# EAGLE design transimp (EAGLE 9.5.2)

## Sheet 1 of 2
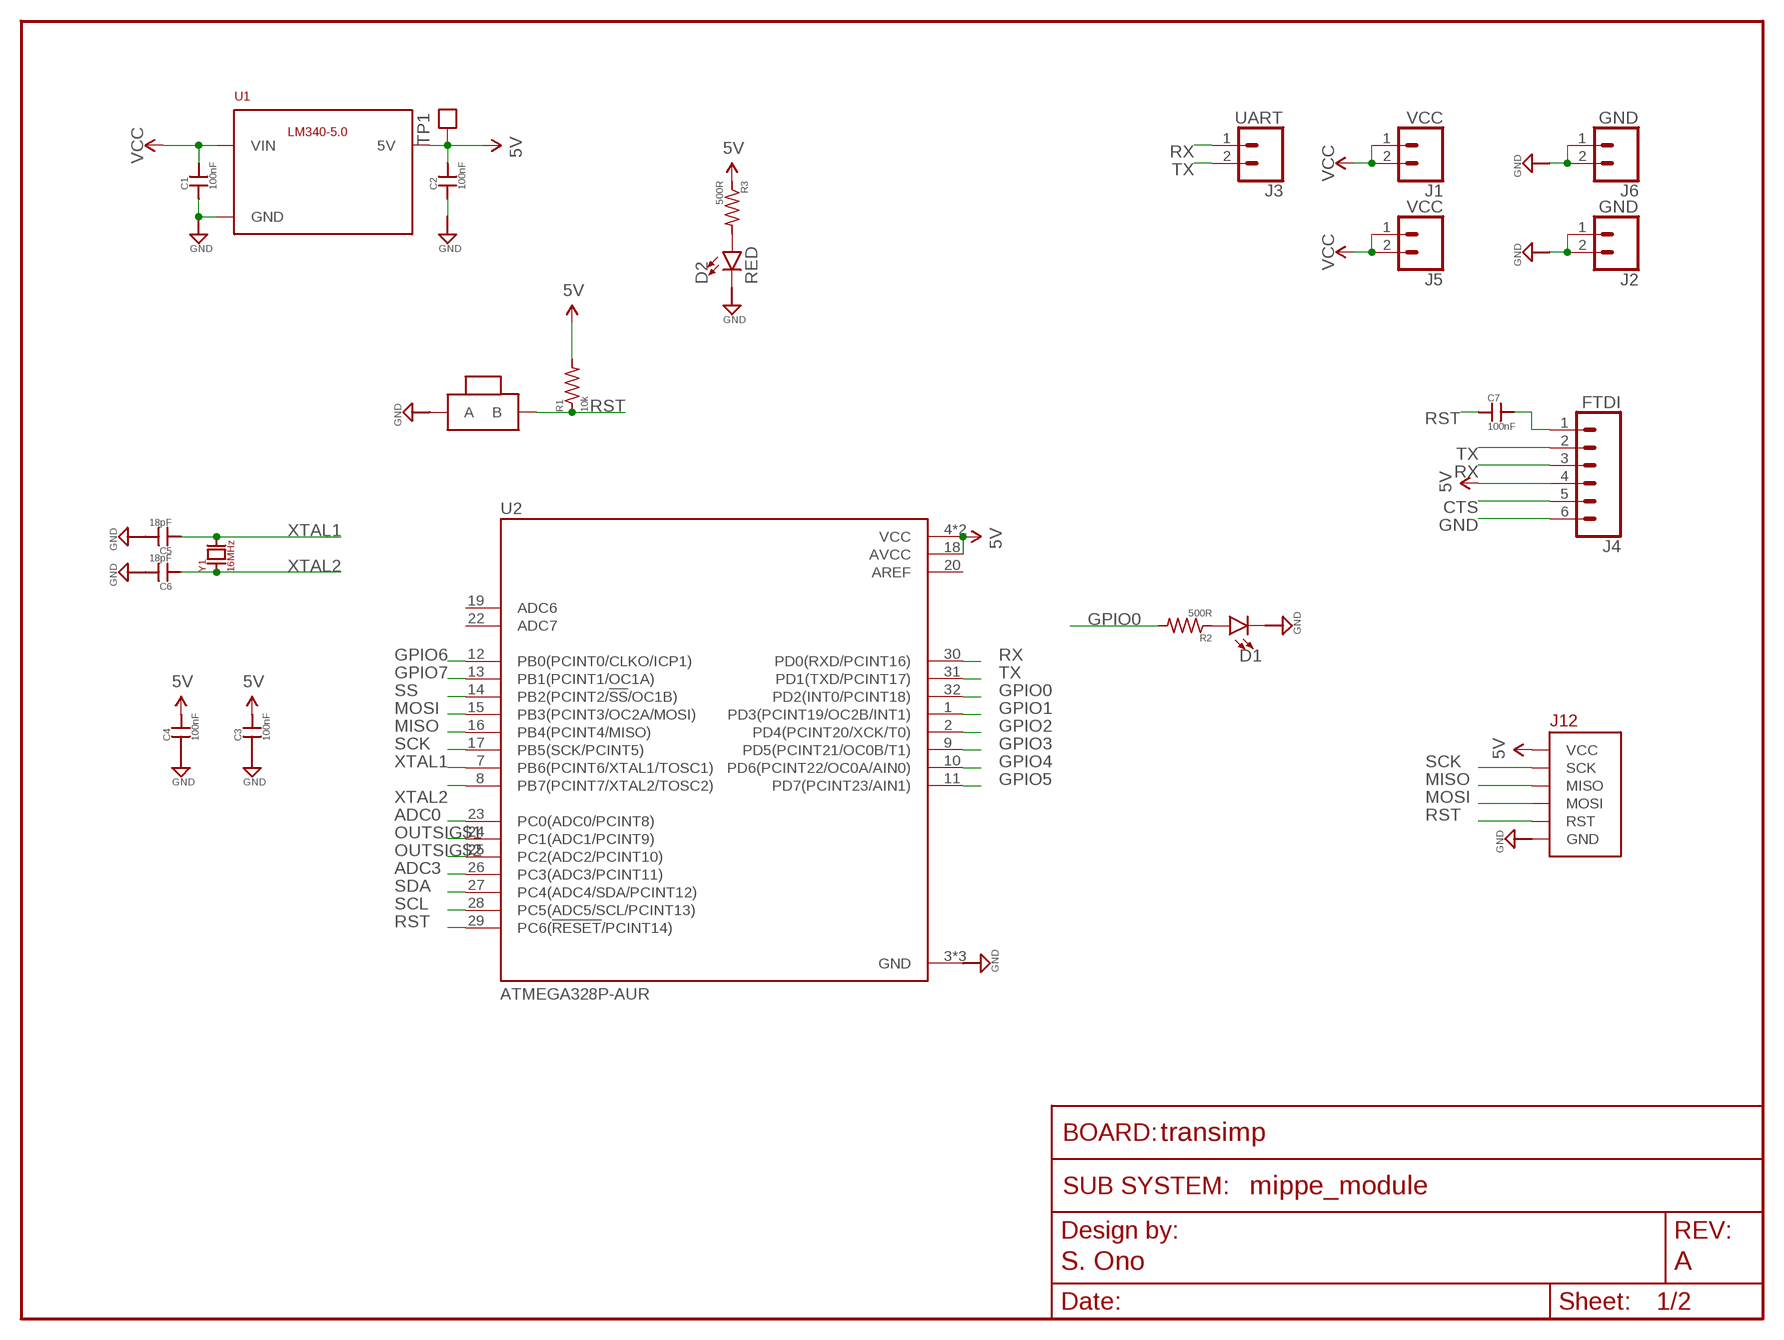
[diagram p0: schematic, sheet 1]
FRAME2 (FRAME_SCHEMATIC): AUTHOR: S. Ono; REV: A; SUBSYSTEM_NAME: mippe_module

### Parts
C1  100nF  CAP0402-CAP  [0402-CAP]
C2  100nF  CAP0402-CAP  [0402-CAP]
C3  100nF  CAP0402-CAP  [0402-CAP]
C4  100nF  CAP0402-CAP  [0402-CAP]
C5  18pF  CAP0402-CAP  [0402-CAP]
C6  18pF  CAP0402-CAP  [0402-CAP]
C7  100nF  CAP0402-CAP  [0402-CAP]
D1  LED0603  [LED-0603]
D2  RED  LED0603  [LED-0603]
J1  VCC  CONN_02  [1X02]
J2  GND  CONN_02  [1X02]
J3  UART  CONN_02  [1X02]
J4  FTDI  CONN_06NO_SILK_FEMALE_PTH  [1X06_NO_SILK]
J5  VCC  CONN_02  [1X02]
J6  GND  CONN_02  [1X02]
J12  BURNIN  [BURNIN]
R1  10k  R-US_R0402  [R0402]
R2  500R  R-US_R0402  [R0402]
R3  500R  R-US_R0402  [R0402]
SW1  BTN-PTS810  [BTN_PTS810]
TP1  TEST_POINTTHRU  [TEST_POINT]
U1  LM340MPX-5.0230  [SOT230P700X180-4N]
U2  ATMEGA328P-AUR  [QFP80P900X900X120-32N]
Y1  16MHz  CRYSTAL_SMOL  [XTAL500X320X130N]

### Nets
5V: C2.2 C3.2 C4.2 J4.4 J12.3.3V(VCC) R1.2 R3.1 TP1.1 U1.3(5V) U2.4(VCC) U2.6(VCC) U2.18(AVCC) ; also sheet 2
ADC0: U2.23(PC0(ADC0/PCINT8))
ADC3: U2.26(PC3(ADC3/PCINT11))
CTS: J4.5
GND: C1.1 C2.1 C3.1 C4.1 C5.2 C6.2 D1.C D2.C J2.1 J2.2 J4.6 J6.1 J6.2 J12.GND SW1.1(A) SW1.2(A) U1.2(GND) U1.4(GND) U2.3(GND) U2.5(GND) U2.21(GND) ; also sheet 2
GPIO0: R2.2 U2.32(PD2(INT0/PCINT18))
GPIO1: U2.1(PD3(PCINT19/OC2B/INT1))
GPIO2: U2.2(PD4(PCINT20/XCK/T0))
GPIO3: U2.9(PD5(PCINT21/OC0B/T1))
GPIO4: U2.10(PD6(PCINT22/OC0A/AIN0))
GPIO5: U2.11(PD7(PCINT23/AIN1))
GPIO6: U2.12(PB0(PCINT0/CLKO/ICP1))
GPIO7: U2.13(PB1(PCINT1/OC1A))
MISO: J12.MISO U2.16(PB4(PCINT4/MISO))
MOSI: J12.MOSI U2.15(PB3(PCINT3/OC2A/MOSI))
N$1: D1.A R2.1
N$2: D2.A R3.2
N$3: C7.2 J4.1
OUTSIG$1: U2.24(PC1(ADC1/PCINT9)) ; also sheet 2
OUTSIG$2: U2.25(PC2(ADC2/PCINT10)) ; also sheet 2
RST: C7.1 J12.RST R1.1 SW1.3(B) SW1.4(B) U2.29(PC6(!RESET!/PCINT14))
RX: J3.1 J4.3 U2.30(PD0(RXD/PCINT16))
SCK: J12.SCK U2.17(PB5(SCK/PCINT5))
SCL: U2.28(PC5(ADC5/SCL/PCINT13)) ; also sheet 2
SDA: U2.27(PC4(ADC4/SDA/PCINT12)) ; also sheet 2
SS: U2.14(PB2(PCINT2/!SS!/OC1B))
TX: J3.2 J4.2 U2.31(PD1(TXD/PCINT17))
VCC: C1.2 J1.1 J1.2 J5.1 J5.2 U1.1(VIN)
XTAL1: C5.1 U2.7(PB6(PCINT6/XTAL1/TOSC1)) Y1.2(B)
XTAL2: C6.1 U2.8(PB7(PCINT7/XTAL2/TOSC2)) Y1.1(A)
Unconnected: U2.19(ADC6) U2.22(ADC7)

## Sheet 2 of 2
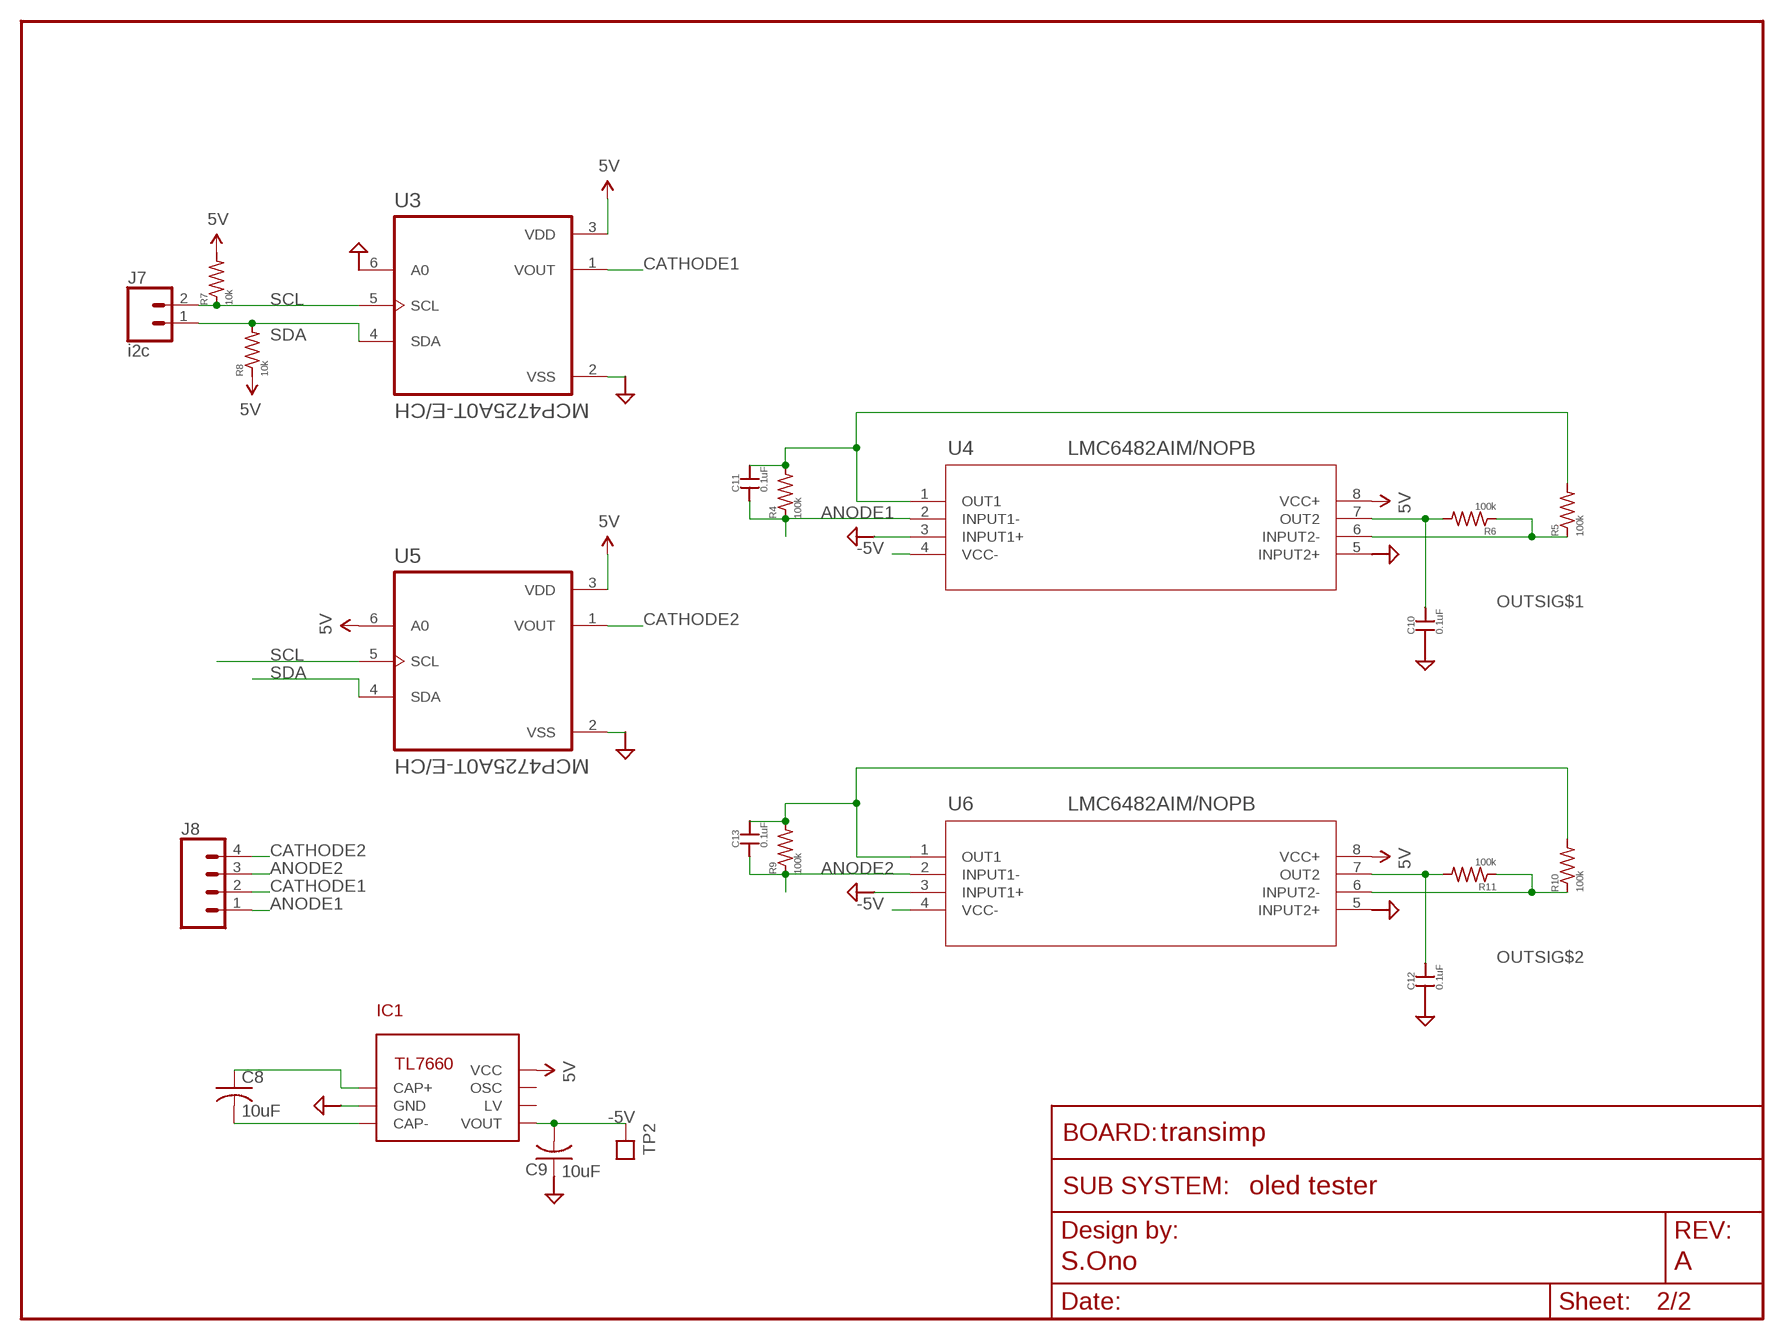
[diagram p1: schematic, sheet 2]
FRAME1 (FRAME_SCHEMATIC): AUTHOR: S.Ono; REV: A; SUBSYSTEM_NAME: oled tester

### Parts
C8  10uF  CAP_ELEC_3MM_SMD  [CAP_3MM]
C9  10uF  CAP_ELEC_3MM_SMD  [CAP_3MM]
C10  0.1uF  CAP0402-CAP  [0402-CAP]
C11  0.1uF  CAP0402-CAP  [0402-CAP]
C12  0.1uF  CAP0402-CAP  [0402-CAP]
C13  0.1uF  CAP0402-CAP  [0402-CAP]
IC1  TL7660  [8SOICW]
J7  i2c  CONN_02  [1X02]
J8  CONN_04  [1X04]
R4  100k  R-US_R0402  [R0402]
R5  100k  R-US_R0402  [R0402]
R6  100k  R-US_R0402  [R0402]
R7  10k  R-US_R0402  [R0402]
R8  10k  R-US_R0402  [R0402]
R9  100k  R-US_R0402  [R0402]
R10  100k  R-US_R0402  [R0402]
R11  100k  R-US_R0402  [R0402]
TP2  TEST_POINTTHRU  [TEST_POINT]
U3  MCP4725A0T-E/CH  [SOT95P270X145-6N]
U4  LMC6482AIM/NOPB  [M08A]
U5  MCP4725A0T-E/CH  [SOT95P270X145-6N]
U6  LMC6482AIM/NOPB  [M08A]

### Nets
5V: IC1.8(VCC) R7.2 R8.1 U3.3(VDD) U4.8(VCC+) U5.3(VDD) U5.6(A0) U6.8(VCC+) ; also sheet 1
-5V: C9.NEG IC1.5(VOUT) TP2.1 U4.4(VCC-) U6.4(VCC-)
ANODE1: C11.1 J8.1 R4.1 U4.2(INPUT1-)
ANODE2: C13.1 J8.3 R9.1 U6.2(INPUT1-)
CATHODE1: J8.2 U3.1(VOUT)
CATHODE2: J8.4 U5.1(VOUT)
GND: C9.POS C10.1 C12.1 IC1.3(GND) U3.2(VSS) U3.6(A0) U4.3(INPUT1+) U4.5(INPUT2+) U5.2(VSS) U6.3(INPUT1+) U6.5(INPUT2+) ; also sheet 1
N$4: C8.POS IC1.2(CAP+)
N$5: C8.NEG IC1.4(CAP-)
N$6: C13.2 R9.2 R10.2 U6.1(OUT1)
N$7: C11.2 R4.2 R5.2 U4.1(OUT1)
N$8: R5.1 R6.1 U4.6(INPUT2-)
N$9: R10.1 R11.1 U6.6(INPUT2-)
OUTSIG$1: C10.2 R6.2 U4.7(OUT2) ; also sheet 1
OUTSIG$2: C12.2 R11.2 U6.7(OUT2) ; also sheet 1
SCL: J7.2 R7.1 U3.5(SCL) U5.5(SCL) ; also sheet 1
SDA: J7.1 R8.2 U3.4(SDA) U5.4(SDA) ; also sheet 1
Unconnected: IC1.6(LV) IC1.7(OSC)

## Power pins joined to a net without a drawn wire
AREF: U2.20(AREF)

## Library data of the parts
C1-C7 C10-C13 = scono:CAP: Capacitor Standard 0603 ceramic capacitor, and 0.1" leaded capacitor.; PIE-INT-REF-NUM: CAPACITOR-GENERIC
C8 C9 = scono:CAP_ELEC: https://www.digikey.com/product-detail/en/nichicon/UWX1C100MCL2GB/493-2099-1-ND/590074
D1 D2 = scono:LED: https://www.digikey.com/products/en/optoelectronics/led-indication-discrete/105?k=&pkeyword=&pv7=2&pv1989=0&pv16=5&FV=ffe00069&quantity=0&ColumnSort=0&page=1&pageSize=25
IC1 = scono:TL7660: https://www.digikey.com/product-detail/en/texas-instruments/TL7660CDR/296-21856-1-ND/1629226
J1-J3 J5-J7 = scono:CONN_02: Multi connection point. Often used as Generic Header-pin footprint for 0.1 inch spaced/style header connections On any of the 0.1 inch spaced packages, you can populate with these: Break Away Headers - Straight <https://www.sparkfun.com/products/116> (PRT-00116) Break Away Male Headers - Right Angle <https://www.sparkfun.com/products/553> (PRT-00553) Female Headers <https://www.sparkfun.com/products/115> (PRT-00115) Break Away Headers - Machine Pin <https://www.sparkfun.com/products/117> (PRT-00117) Break Away Female Headers - Swiss Machine Pin <https://www.sparkfun.com/products/743> (PRT-00743) For SCREWTERMINALS and SPRING TERMINALS visit here: Screw Terimnals on SparkFun.com <https://www.sparkfun.com/search/results?term=Screw+Terminals> (5mm/3.5mm/2.54mm spacing) This device is also useful as a general connection point to wire up your design to another part of your project. Our various solder wires solder well into these plated through hole pads. Hook-Up Wire - Assortment (Stranded, 22 AWG) <https://www.sparkfun.com/products/11375> (PRT-11375) Hook-Up Wire - Assortment (Solid Core, 22 AWG) <https://www.sparkfun.com/products/11367> (PRT-11367) View the entire wire category on our website here <https://www.sparkfun.com/categories/141> Special notes: Molex polarized connector foot print use with: PRT-08233 with associated crimp pins and housings. 2.54_SCREWTERM for use with PRT-10571. 3.5mm Screw Terminal footprints for PRT-08084 5mm Screw Terminal footprints for use with PRT-08432
J4 = scono:CONN_06: Multi connection point. Often used as Generic Header-pin footprint for 0.1 inch spaced/style header connections On any of the 0.1 inch spaced packages, you can populate with these: Break Away Headers - Straight <https://www.sparkfun.com/products/116> (PRT-00116) Break Away Male Headers - Right Angle <https://www.sparkfun.com/products/553> (PRT-00553) Female Headers <https://www.sparkfun.com/products/115> (PRT-00115) Break Away Headers - Machine Pin <https://www.sparkfun.com/products/117> (PRT-00117) Break Away Female Headers - Swiss Machine Pin <https://www.sparkfun.com/products/743> (PRT-00743) Arduino Stackable Header - 6 Pin <https://www.sparkfun.com/products/9280> (PRT-09280) For SCREWTERMINALS and SPRING TERMINALS visit here: Screw Terimnals on SparkFun.com <https://www.sparkfun.com/search/results?term=Screw+Terminals> (5mm/3.5mm/2.54mm spacing) This device is also useful as a general connection point to wire up your design to another part of your project. Our various solder wires solder well into these plated through hole pads. Hook-Up Wire - Assortment (Stranded, 22 AWG) <https://www.sparkfun.com/products/11375> (PRT-11375) Hook-Up Wire - Assortment (Solid Core, 22 AWG) <https://www.sparkfun.com/products/11367> (PRT-11367) View the entire wire category on our website here <https://www.sparkfun.com/categories/141>; PROD_ID: CONN-08437
J8 = scono:CONN_04: Multi connection point. Often used as Generic Header-pin footprint for 0.1 inch spaced/style header connections On any of the 0.1 inch spaced packages, you can populate with these: Break Away Headers - Straight <https://www.sparkfun.com/products/116> (PRT-00116) Break Away Male Headers - Right Angle <https://www.sparkfun.com/products/553> (PRT-00553) Female Headers <https://www.sparkfun.com/products/115> (PRT-00115) Break Away Headers - Machine Pin <https://www.sparkfun.com/products/117> (PRT-00117) Break Away Female Headers - Swiss Machine Pin <https://www.sparkfun.com/products/743> (PRT-00743) For SCREWTERMINALS and SPRING TERMINALS visit here: Screw Terimnals on SparkFun.com <https://www.sparkfun.com/search/results?term=Screw+Terminals> (5mm/3.5mm/2.54mm spacing) This device is also useful as a general connection point to wire up your design to another part of your project. Our various solder wires solder well into these plated through hole pads. Hook-Up Wire - Assortment (Stranded, 22 AWG) <https://www.sparkfun.com/products/11375> (PRT-11375) Hook-Up Wire - Assortment (Solid Core, 22 AWG) <https://www.sparkfun.com/products/11367> (PRT-11367) View the entire wire category on our website here <https://www.sparkfun.com/categories/141> Special notes: Molex polarized connector foot print use with SKU : PRT-08231 with associated crimp pins and housings. 1MM SMD Version SKU: PRT-10208; PROD_ID: CONN-09696
J12 = scono:BURNIN
R1-R11 = scono:R-US_: RESISTOR, American symbol
SW1 = scono:BTN-PTS810: https://www.digikey.com/product-detail/en/c-k/PTS810-SJM-250-SMTR-LFS/CKN10502CT-ND/4176673
TP1 TP2 = scono:TEST_POINT: 1206 Test point for O-scope probes. For A106146CT-ND or similar
U1 = scono:LM340MPX-5.0
U2 = scono:ATMEGA328P-AUR: ATmega328P Series 8 Bit 2 kB RAM 32 kB Flash SMT Microcontroller - TQFP-32; DESCRIPTION: ATmega328P Series 8 Bit 2 kB RAM 32 kB Flash SMT Microcontroller - TQFP-32; DIGI-KEY_PART_NUMBER: ATMEGA328P-AURCT-ND; DIGI-KEY_PURCHASE_URL: https://www.digikey.com/product-detail/en/microchip-technology/ATMEGA328P-AUR/ATMEGA328P-AURCT-ND/3789455?utm_source=snapeda&utm_medium=aggregator&utm_campaign=symbol; MF: Microchip; MP: ATMEGA328P-AUR; PACKAGE: TQFP-32 Microchip
U3 U5 = scono:MCP4725A0T-E/CH: MCP4725 Series 1 Ch I2C EEPROM Memory 5.5 V 12-Bit D/A Converter SMT - SOT-23-6; DESCRIPTION: 12 Bit Digital to Analog Converter 1 SOT-23-6; DIGI-KEY_PART_NUMBER: MCP4725A0T-E/CHCT-ND; DIGI-KEY_PURCHASE_URL: https://www.digikey.com/product-detail/en/microchip-technology/MCP4725A0T-E-CH/MCP4725A0T-E-CHCT-ND/1817328?utm_source=snapeda&utm_medium=aggregator&utm_campaign=symbol; MF: Microchip; MP: MCP4725A0T-E/CH; PACKAGE: SOT-23-6 Microchip
U4 U6 = scono:LMC6482AIM/NOPB; BUILT_BY: EMA_UL_Team; MANUFACTURER_PART_NUMBER: LMC6482AIM/NOPB; VENDOR: Texas Instruments
Y1 = scono:CRYSTAL

## Board
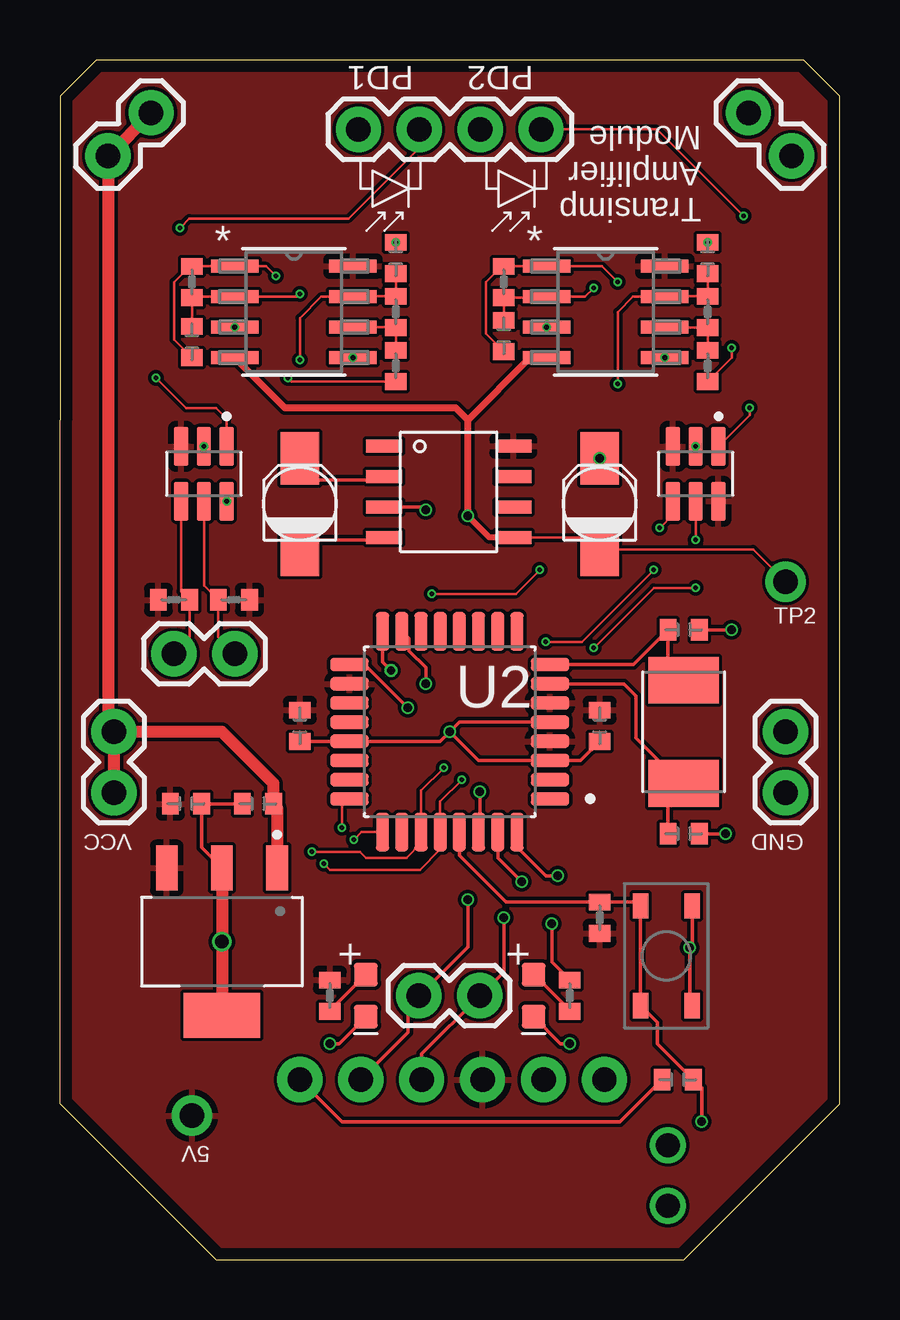
[diagram p2: board, top side]
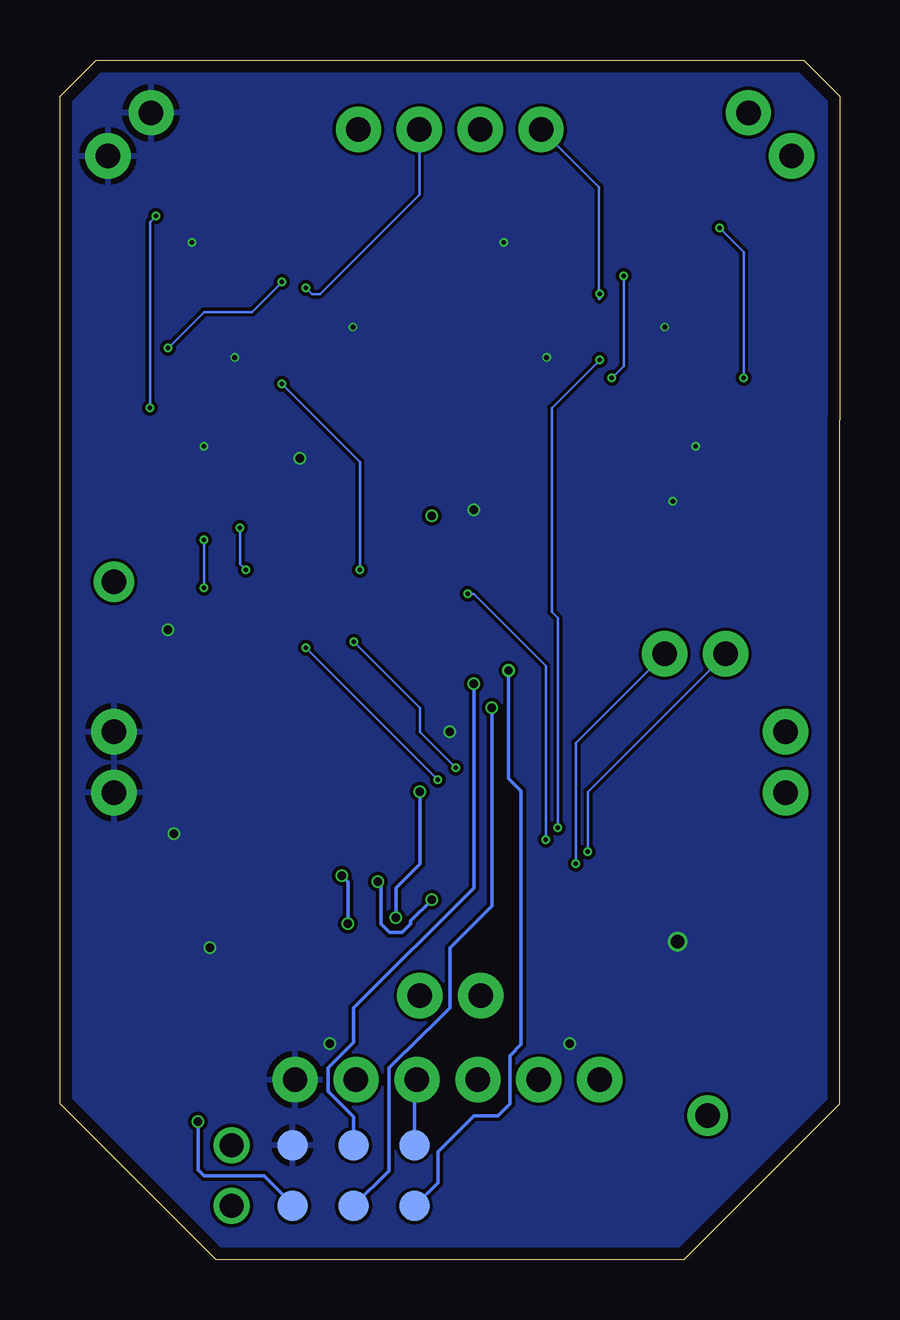
[diagram p3: board, bottom side, seen from below]

Size 32.5 x 50 mm. Coordinates in mm from the lower left corner, seen from the top.
Outline: 6.5,0 0,6.5 0,35 0,48.5 1.5,50 31,50 32.5,48.5 32.5,30.5 32.5,6.5 26,0 6.5,0
Copper layers (1*16): Top 2mil / dielectric 9mil / Bottom 2mil
Design rules "scono": minimum track width 3.5mil, minimum drill 0.2mm, track to track 5.5mil, track to pad 5.5mil, pad to pad 5.5mil, via to via 5.5mil, smd to smd 0mil, copper to edge 0.5mm, drill to drill 0.5mm, minimum pad ring 3mil, minimum via ring 3mil, stop-mask expansion 3mil, vias tented up to drill 0mil, thermal gap 10mil

### Footprints (pad centres in the part's own frame; a part is rotated, then mirrored left to right if it is on the bottom)
0402-CAP = smd 0.7 x 0.9: 1 -0.65,0; 2 0.65,0
CAP_3MM = smd 1.6 x 2.2: NEG 0,-1.9; POS 0,1.9
LED-0603 = smd 1 x 1: A 0.877,0; C -0.877,0
8SOICW = smd 0.55 x 1.5: 1 -1.905,0; 2 -0.635,0; 3 0.635,0; 4 1.905,0; 5 1.905,5.4; 6 0.635,5.4; 7 -0.635,5.4; 8 -1.905,5.4
1X02 = drill 1.016 pad 1.88: 1 0,0; 2 2.54,0
1X06_NO_SILK = drill 1.016 pad 1.88: 1 0,0; 2 2.54,0; 3 5.08,0; 4 7.62,0; 5 10.16,0; 6 12.7,0
1X04 = drill 1.016 pad 1.88: 1 0,0; 2 2.54,0; 3 5.08,0; 4 7.62,0
BURNIN = smd 1.27 x 1.27 bottom: 3.3V 0,0; GND -5.08,0; MISO 0,2.54; MOSI -2.54,0; RST -5.08,2.54; SCK -2.54,2.54 | drill 1: P$7 -7.62,2.54; P$8 -7.62,0
R0402 = smd 0.7 x 0.9: 1 -0.65,0; 2 0.65,0
BTN_PTS810 = smd 1.05 x 0.65: 1 -2.075,1.075; 2 2.075,1.075; 3 -2.075,-1.075; 4 2.075,-1.075
TEST_POINT = drill 1.016 pad 1.676: 1 0,0
SOT230P700X180-4N = smd 1.86 x 0.9: 1 -3.075,2.3; 2 -3.075,0; 3 -3.075,-2.3 | smd 1.86 x 3.19: 4 3.075,0
QFP80P900X900X120-32N = smd 1.6 x 0.55: 1 -4.18,2.8; 2 -4.18,2; 3 -4.18,1.2; 4 -4.18,0.4; 5 -4.18,-0.4; 6 -4.18,-1.2; 7 -4.18,-2; 8 -4.18,-2.8; 17 4.18,-2.8; 18 4.18,-2; 19 4.18,-1.2; 20 4.18,-0.4; 21 4.18,0.4; 22 4.18,1.2; 23 4.18,2; 24 4.18,2.8 | smd 0.55 x 1.6: 9 -2.8,-4.18; 10 -2,-4.18; 11 -1.2,-4.18; 12 -0.4,-4.18; 13 0.4,-4.18; 14 1.2,-4.18; 15 2,-4.18; 16 2.8,-4.18; 25 2.8,4.18; 26 2,4.18; 27 1.2,4.18; 28 0.4,4.18; 29 -0.4,4.18; 30 -1.2,4.18; 31 -2,4.18; 32 -2.8,4.18
SOT95P270X145-6N = smd 1.61 x 0.59: 1 -1.145,0.95; 2 -1.145,0; 3 -1.145,-0.95; 4 1.145,-0.95; 5 1.145,0; 6 1.145,0.95
M08A = smd 1.981 x 0.559: 1 -2.464,1.905; 2 -2.464,0.635; 3 -2.464,-0.635; 4 -2.464,-1.905; 5 2.464,-1.905; 6 2.464,-0.635; 7 2.464,0.635; 8 2.464,1.905
XTAL500X320X130N = smd 1.95 x 2.95: 1 -2.15,0; 2 2.15,0

### Placement (x,y rotation side)
C1  8.25,19 0 top
C2  5.25,19 180 top
C3  10,22.25 90 top
C4  22.5,22.25 90 top
C5  26,17.75 0 top
C6  26,26.25 0 top
C7  25.75,7.5 180 top
C8  10,31.5 0 top
C9  22.5,31.5 0 top
C10  14,41.75 270 top
C11  5.5,38.25 270 top
C12  27,41.75 270 top
C13  18.5,38.5 270 top
D1  19.75,11 90 top
D2  12.75,11 90 top
IC1  13.5,32 270 top
J1  2.25,22 270 top
J2  30.25,22 270 top
J3  17.5,11 180 top
J4  10,7.5 0 top
J5  2,46 45 top
J6  30.5,46 135 top
J7  4.75,25.25 0 top
J8  12.44,47.11 0 top
J12  17.72,4.77 180 top
R1  22.5,14.25 270 top
R2  21.25,11 90 top
R3  11.25,11 270 top
R4  5.5,40.75 90 top
R5  14,37.25 270 top
R6  14,39.5 90 top
R7  7.25,27.5 0 top
R8  4.75,27.5 0 top
R9  18.5,40.75 90 top
R10  27,37.25 270 top
R11  27,39.5 90 top
SW1  25.28,12.66 270 top
TP1  5.5,6 0 top
TP2  30.25,28.25 0 top
U1  6.75,13.25 270 top
U2  16.25,22 180 top
U3  6,32.75 270 top
U4  9.75,39.5 0 top
U5  26.5,32.75 270 top
U6  22.75,39.5 0 top
Y1  26,22 270 top

### Tracks (layer width: path | path; a pad name or v marks a point on that pad's centre or on a via)
5V
  Bottom 0.152: J12.3.3V 17.72,7.4 J4.4
  pour Top: 36.75,-1.25 -7.75,-1.25 -7.75,50.75 36.75,50.75
-5V  (via drill 0.35)
  Top 0.1: IC1.5 22,30.09 C9.NEG 28.9,29.6 TP2.1
  Top 0.254: IC1.5 17.91,30.09 v17,31
  Top 0.3: v17,31 17,35 | 17,35 19.59,37.59 U6.4 | 17,35 16.5,35.5 9.38,35.5 U4.4
ANODE1  (via drill 0.2)
  Top 0.1: R4.1 5.54,40.13 5.75,40.13 | 5.75,40.13 U4.2 9.88,40.13 v10,40.25 | C11.1 5.5,39.88 5.75,40.13
  Bottom 0.1: J8.1 10.03,44.69 10.03,40.02 10,40.05 v10,40.25
ANODE2  (via drill 0.2)
  Top 0.1: C13.1 R9.1 20.25,40.1 U6.2 21.89,40.13 v22.25,40.5
  Bottom 0.1: v22.25,40.5 22,40.25 21.66,40.25 17.52,44.39 J8.3
CATHODE1  (via drill 0.2)
  Top 0.1: U3.1 6.95,35.05 6.5,35.5 5.25,35.5 v4,36.75 | v5,43 5.39,43.39 12.03,43.39 14.98,46.34 J8.2
  Bottom 0.1: v4,36.75 4,42 v5,43
CATHODE2  (via drill 0.2)
  Top 0.1: U5.1 28.75,35.2 v28.75,35.5 | J8.4 24.89,47.11 v28.5,43.5
  Bottom 0.1: v28.75,35.5 28.75,43.25 v28.5,43.5
GND  (via drill 0.2, 0.35, 0.55)
  Top 0.152: U1.2 5.9,17.18 C2.1 C1.1 | C3.1 U2.21 15.85,21.6 v16.25,22 | C6.2 v28,26.25 | C4.1 21.7,20.8 U2.3 17.45,20.8 v16.25,22 | U2.5 16.65,22.4 v16.25,22 | C5.2 v27.75,17.75 | SW1.1 26.36,13.11 v26.25,13 26.25,10.69 SW1.2 | D1.C 20.87,9 v21.25,9 | D2.C 11.63,9 v11.25,9 | IC1.3 15.13,31.36 v15.25,31.25
  Top 0.508: U1.2 v6.75,13.25 U1.4
  other vias: 22.5,33.4 12.21,37.59 7.29,38.87 14,42.4 20.29,38.87 25.21,37.59 27,42.4 6,33.9 6.95,31.61 26.5,33.9
  pour Bottom: 36.75,-1.25 -7.75,-1.25 -7.75,50.75 36.75,50.75
GPIO0  (via drill 0.35)
  Top 0.152: R2.2 20.5,12.4 v20.5,14 | v20.75,16 20.25,16 19.05,17.2 U2.32
  Bottom 0.152: v20.5,14 20.5,15.75 v20.75,16
MISO  (via drill 0.35)
  Top 0.152: U2.16 13.45,24.91 v13.8,24.55
  Bottom 0.152: v13.8,24.55 13.8,20.05 13.38,19.62 13.28,19.53 13.28,8.97 13.75,8.5 13.75,6.5 14.25,6 15.25,6 16.75,4.5 16.75,3.2 J12.MISO
MOSI  (via drill 0.35)
  Top 0.152: U2.15 14.55,25.88 14.55,25.37 15.25,24.67 v15.25,24
  Bottom 0.152: J12.MOSI 20.26,5.95 21.33,7.02 21.33,7.98 20.26,9.05 20.26,10.49 15.25,15.5 v15.25,24
N$1
  Top 0.152: D1.A 21.25,10.38 R2.1
N$2
  Top 0.152: D2.A 11.25,10.38 R3.2
N$3
  Top 0.152: J4.1 11.75,5.75 23.35,5.75 C7.2
N$4
  Top 0.152: IC1.2 13.5,32.5 10,32.5 10,33 C8.POS
N$5
  Top 0.152: IC1.4 13.5,30 10,30 C8.NEG
N$6  (via drill 0.2)
  Top 0.1: R9.2 18.75,41.41 | 18.75,41.41 U6.1 22.59,41.41 v23.25,40.75 | C13.2 17.75,38.6 17.75,40.75 18.41,41.41 18.75,41.41 | v28,38 28,37.6 R10.2
  Bottom 0.1: v23.25,40.75 24.5,39.5 26.5,39.5 v28,38
N$7  (via drill 0.2)
  Top 0.1: C11.2 4.75,38.35 4.75,40.75 5.4,41.4 R4.2 U4.1 8.6,41.41 v9,41 | R5.2 9.65,36.6 v9.5,36.75
  Bottom 0.1: v9.5,36.75 9,37.25 v9,41
N$8
  Top 0.1: R5.1 R6.1 13.98,38.87 U4.6
N$9
  Top 0.1: U6.6 25.23,38.85 R11.1 R10.1
OUTSIG$1  (via drill 0.2)
  Top 0.1: U2.24 11.75,18.88 v11.75,18 | C10.2 R6.2 12.23,40.15 U4.7 10.88,40.13 10,39.25 v10,37.5
  Bottom 0.1: v10,37.5 12,35.5 12,27 11.75,26.75 v11.75,18
OUTSIG$2  (via drill 0.2)
  Top 0.1: U2.25 12.57,17.82 v12.25,17.5 | C12.2 R11.2 25.23,40.15 U6.7 23.89,40.13 23.25,39.5 v23.25,36.5 | v15.5,27.75 19,27.75 v20,28.75
  Bottom 0.1: v12.25,17.5 12.25,24.75 15.25,27.75 v15.5,27.75 | v20,28.75 20,33.25 v23.25,36.5
RST  (via drill 0.35)
  Top 0.152: 24.09,14.85 24.04,14.9 R1.1 18.6,14.9 16.65,16.85 U2.29 | 24.09,14.85 SW1.3 | SW1.3 SW1.4 24.9,9.89 24.9,9 C7.1 26.75,7.15 v26.75,5.75 | SW1.3 24.09,14.85
  Bottom 0.152: J12.RST 22.8,2.3 24,3.5 26.5,3.5 26.75,3.75 v26.75,5.75
RX  (via drill 0.35)
  Top 0.152: v17.5,19.5 17.5,17.87 U2.30 | v18.5,14.25 18.5,12 J3.1 15.08,8.58 J4.3
  Bottom 0.152: v18.5,14.25 18.5,15.5 17.5,16.5 v17.5,19.5
SCK  (via drill 0.35)
  Top 0.152: U2.17 12.7,24.8 v14.5,23
  Bottom 0.152: J12.SCK 18.79,3.7 18.79,7.98 18.1,8.67 18.08,8.67 16.25,10.5 16.25,13 14.5,14.75 v14.5,23
SCL  (via drill 0.2)
  Top 0.1: U3.5 6,28.1 R7.1 6.6,25.94 J7.2 | v11,16.5 11.25,16.25 15,16.25 15.85,17.1 U2.28 15.85,19.1 v16.75,20 | v26.5,30 U5.5 | v26.5,28 24.75,28 v22.25,25.5
  Bottom 0.1: J7.2 11,21.54 v11,16.5 | v16.75,20 v22.25,25.5 | v26.5,28 v26.5,30
SDA  (via drill 0.2)
  Top 0.1: U3.4 5.05,27.85 R8.2 5.4,25.9 J7.1 | v10.5,17 12.5,17 12.75,16.75 14.44,16.75 15.05,17.36 U2.27 15.05,19.55 v16,20.5 | v24.75,28.75 21.75,25.75 v20.25,25.75 | U5.4 25.55,31.05 v25,30.5
  Bottom 0.1: J7.1 10.5,19.5 v10.5,17 | v20.25,25.75 17.5,23 17.5,22 v16,20.5 | v25,30.5 25,29 v24.75,28.75
TX  (via drill 0.35)
  Top 0.152: v19.25,15.75 18.25,16.75 U2.31 | J4.2 14.5,9.46 14.5,10.54 J3.2 17,13.04 v17,15
  Bottom 0.152: v19.25,15.75 19.11,15.61 19.11,14 18.75,13.64 18.25,13.64 17.89,14 17.89,14.11 v17,15
VCC
  Top 0.508: U1.1 9.05,18.85 C1.2 8.9,19.85 6.75,22 J1.1 | J1.2 J1.1 | J5.2 J5.1 2,22.25 J1.1
XTAL1
  Top 0.152: U2.7 23.5,24 24,23.5 24,21.75 25.9,19.85 Y1.2 25.35,19.2 C5.1
XTAL2
  Top 0.152: U2.8 23.9,24.8 C6.1 25.35,24.8 Y1.1

### Text on the board
tPlace: PD1 | PD2 | Transimp / Amplifier / Module | VCC | GND
tNames: U2 | 5V